# EAGLE design analogBuffer (EAGLE 5.09)
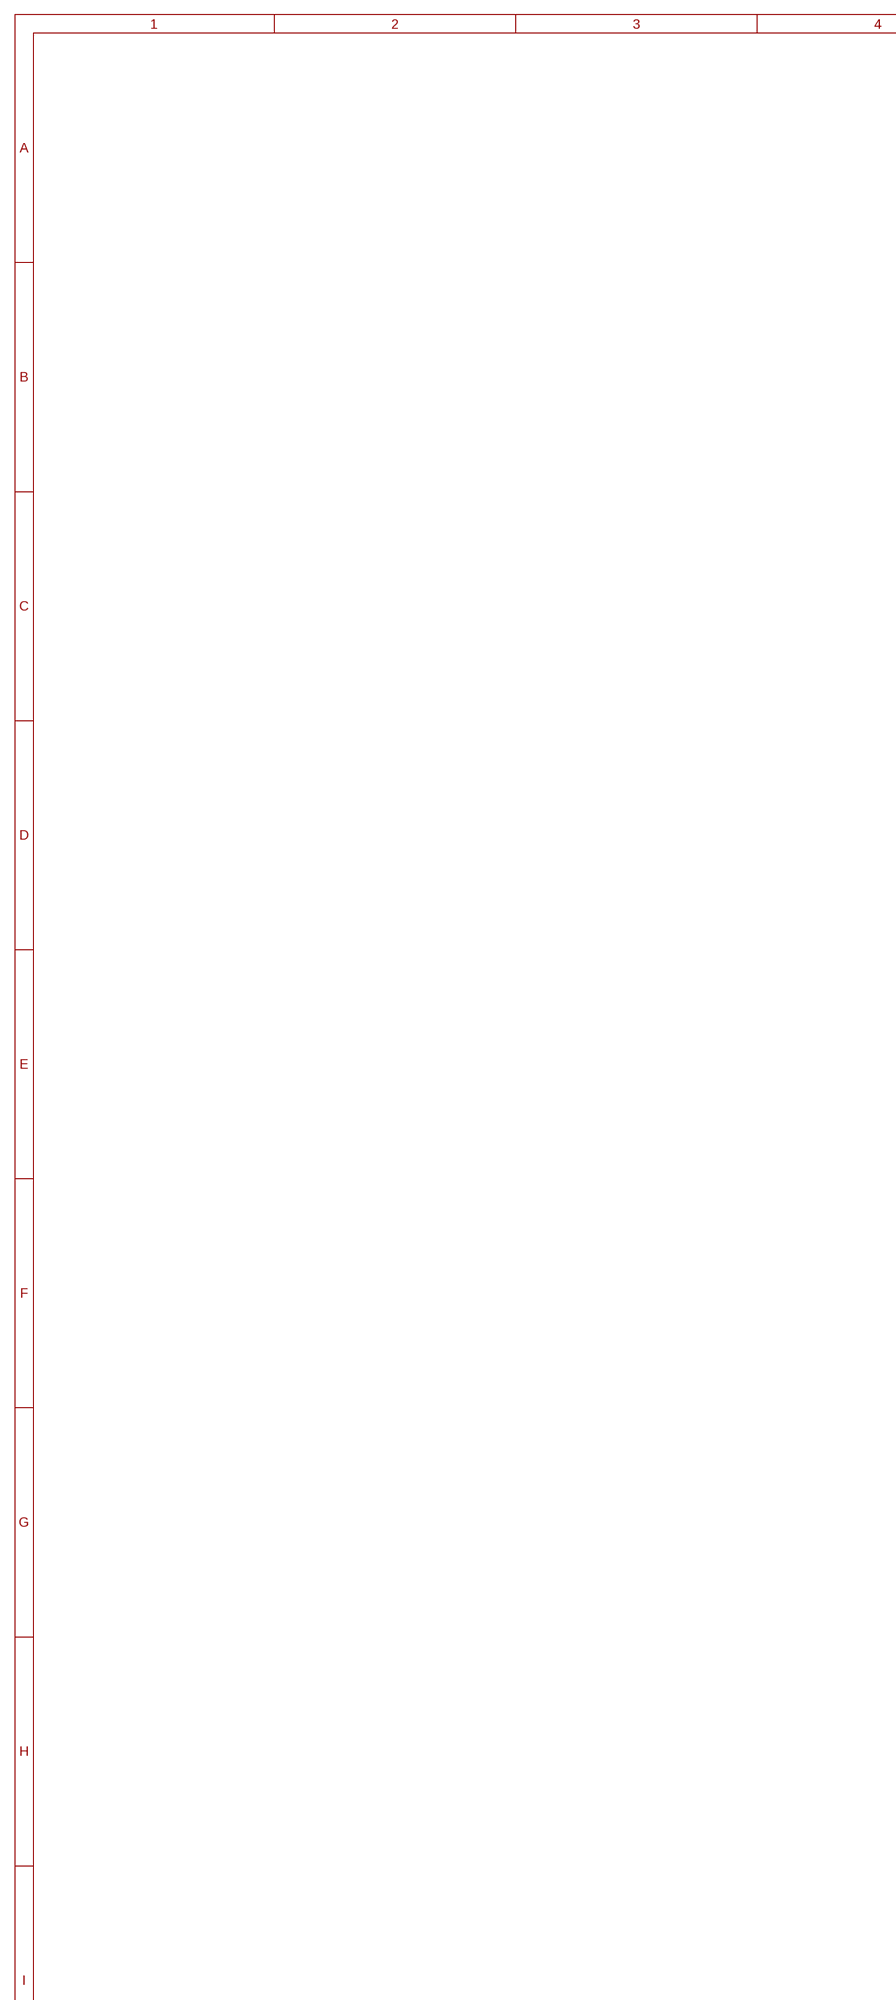
[diagram p0: schematic, sheet 1, part 1 of 2]
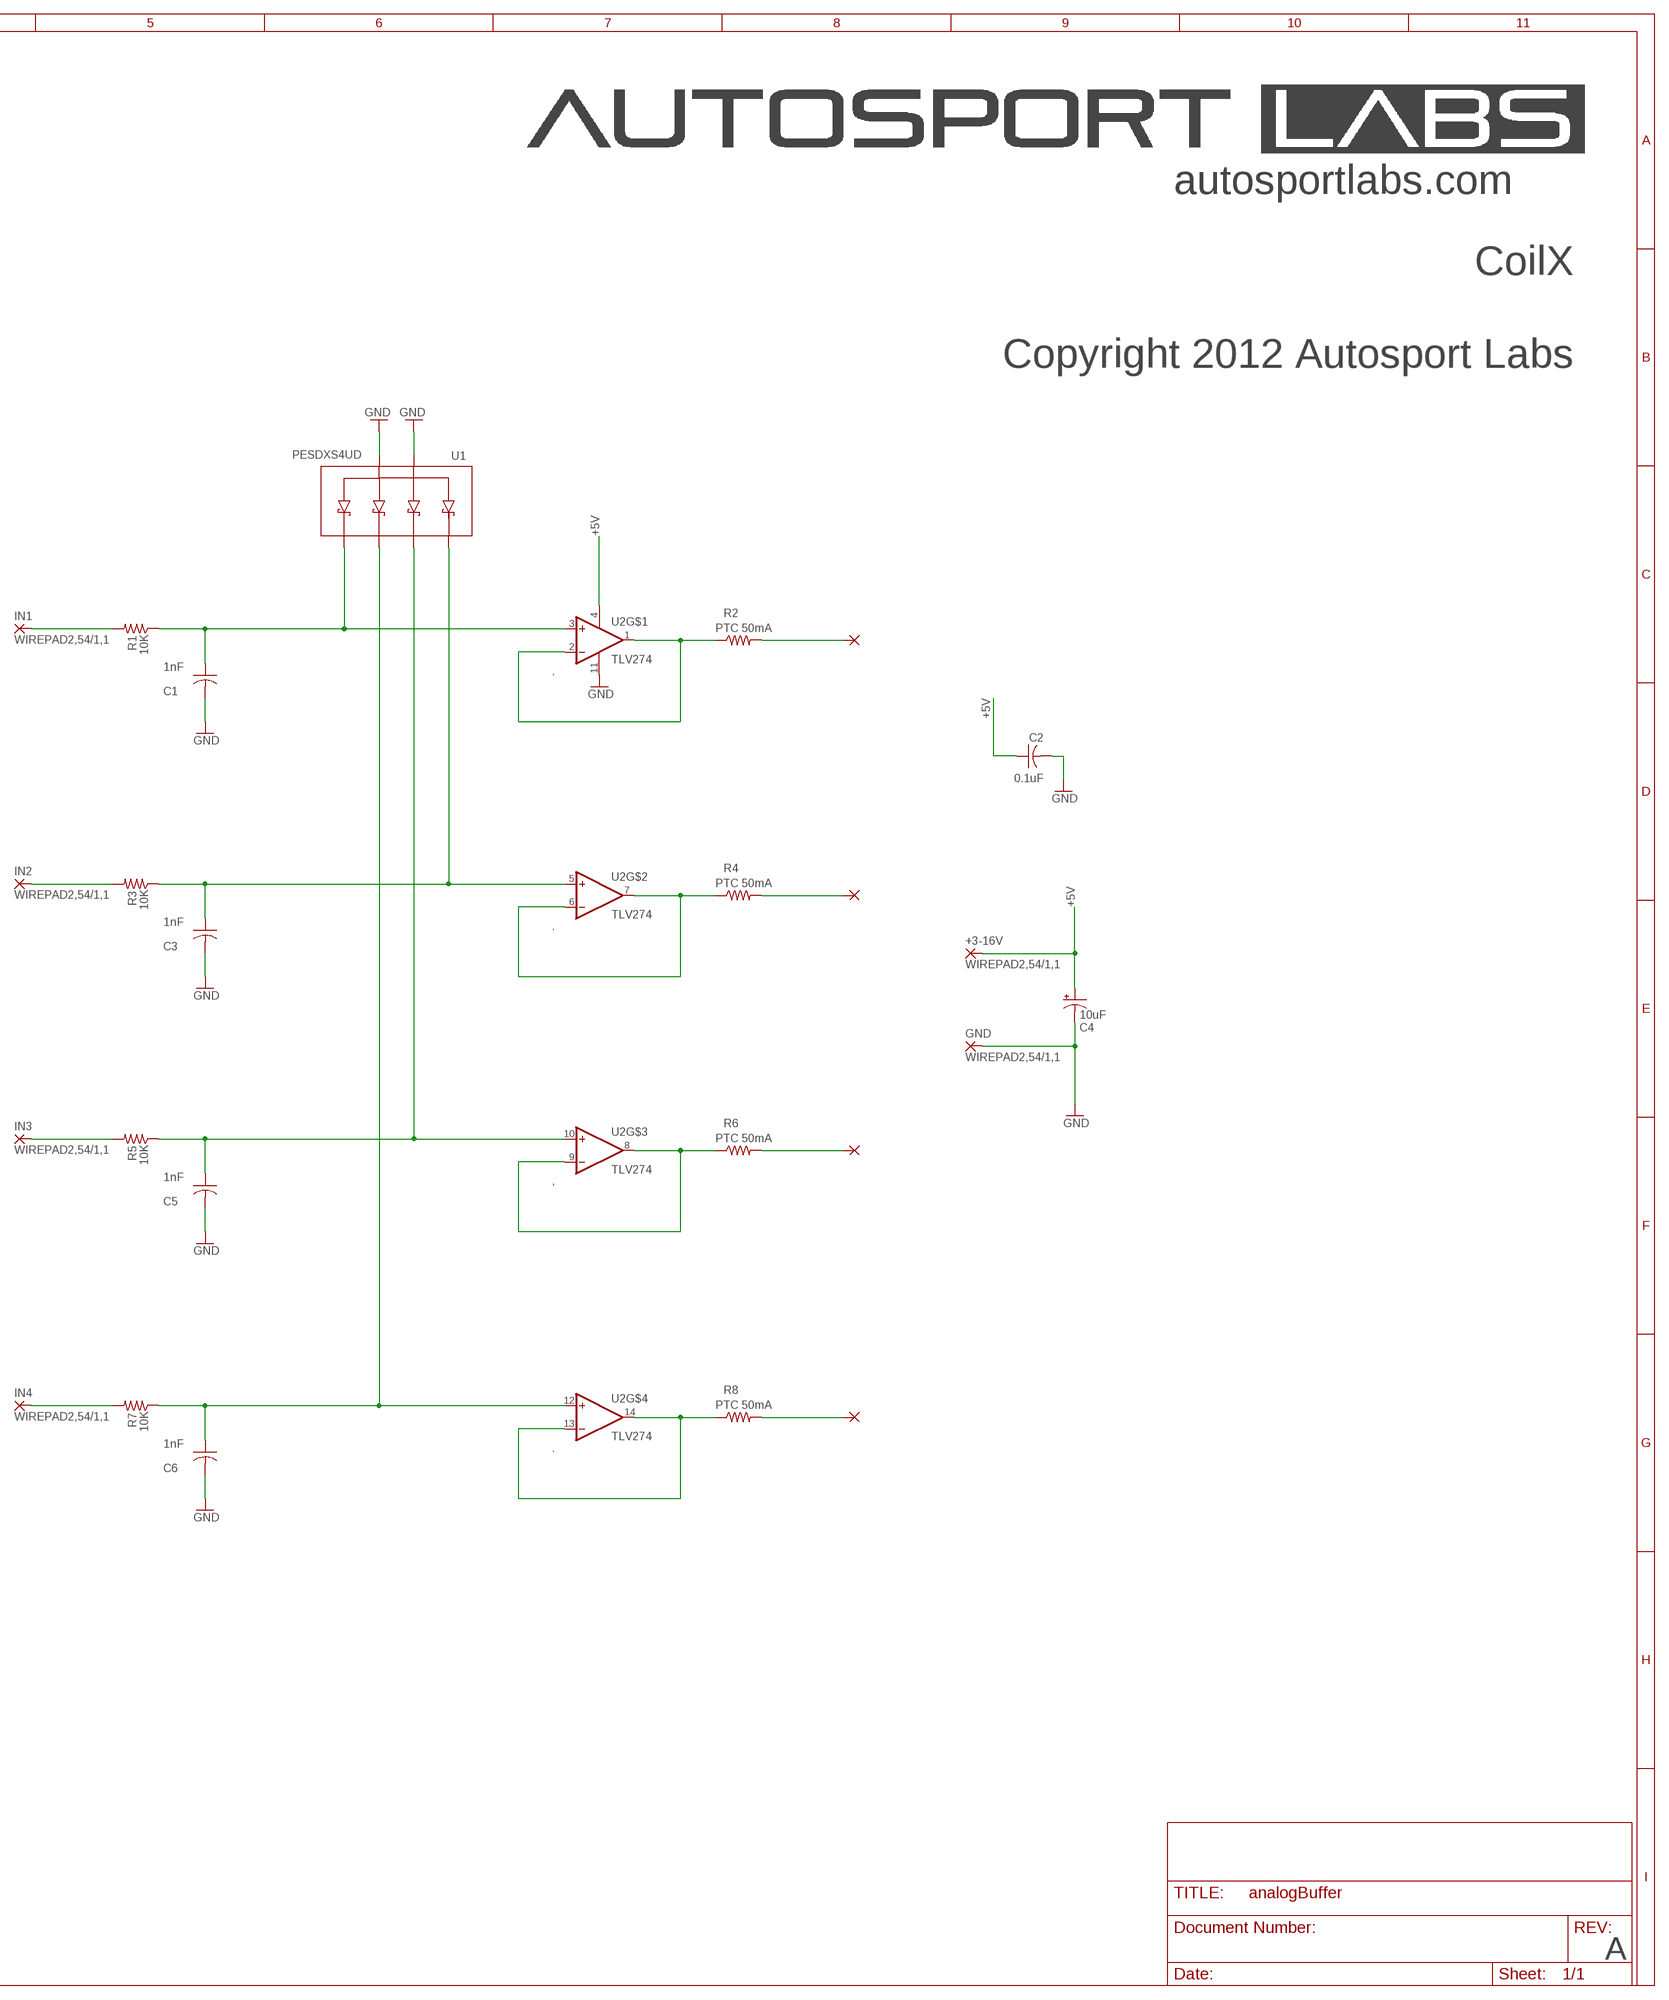
[diagram p1: schematic, sheet 1, part 2 of 2]

## Parts
+3-16V  WIREPAD2,54/1,1  [2,54/1,1]
C1  1nF  C-USC0603  [C0603]
C2  0.1uF  C-USC0603  [C0603]
C3  1nF  C-USC0603  [C0603]
C4  10uF  CPOL-USSMCA  [SMC_A]
C5  1nF  C-USC0603  [C0603]
C6  1nF  C-USC0603  [C0603]
GND  WIREPAD2,54/1,1  [2,54/1,1]
IN1  WIREPAD2,54/1,1  [2,54/1,1]
IN2  WIREPAD2,54/1,1  [2,54/1,1]
IN3  WIREPAD2,54/1,1  [2,54/1,1]
IN4  WIREPAD2,54/1,1  [2,54/1,1]
OUT1  WIREPAD2,54/1,1  [2,54/1,1]
OUT2  WIREPAD2,54/1,1  [2,54/1,1]
OUT3  WIREPAD2,54/1,1  [2,54/1,1]
OUT4  WIREPAD2,54/1,1  [2,54/1,1]
R1  10K  R-US_R1206  [R1206]
R2  PTC 50mA  R-US_R1206  [R1206]
R3  10K  R-US_R1206  [R1206]
R4  PTC 50mA  R-US_R1206  [R1206]
R5  10K  R-US_R1206  [R1206]
R6  PTC 50mA  R-US_R1206  [R1206]
R7  10K  R-US_R1206  [R1206]
R8  PTC 50mA  R-US_R1206  [R1206]
U1  PESDXS4UD  [SC-74]
U2  TLV274  TLV274SO14  [SO14]

## Nets
+5V: +3-16V.1(P) C2.1 C4.+ U2.4(V+)
ANALOG-FREQ_1_OPAMP_OUT: R2.1 U2.1(OUT) U2.2(-IN)
ANALOG-FREQ_1_OPAMP_OUT1: R4.1 U2.6(-IN) U2.7(OUT)
ANALOG-FREQ_1_OPAMP_OUT2: R6.1 U2.8(OUT) U2.9(-IN)
ANALOG-FREQ_1_OPAMP_OUT3: R8.1 U2.13(-IN) U2.14(OUT)
GND: C1.2 C2.2 C3.2 C4.- C5.2 C6.2 GND.1(P) U1.2 U1.5 U2.11(V-)
N$2: C1.1 R1.1 U1.6 U2.3(+IN)
N$3: IN1.1(P) R1.2
N$4: OUT1.1(P) R2.2
N$5: C3.1 R3.1 U1.1 U2.5(+IN)
N$6: IN2.1(P) R3.2
N$7: OUT2.1(P) R4.2
N$9: C5.1 R5.1 U1.3 U2.10(+IN)
N$11: IN3.1(P) R5.2
N$12: OUT3.1(P) R6.2
N$14: C6.1 R7.1 U1.4 U2.12(+IN)
N$15: IN4.1(P) R7.2
N$16: OUT4.1(P) R8.2

## Notes on the sheet
- autosportlabs.com
- CoilX
- Copyright 2012 Autosport Labs
- A

## Library data of the parts
+3-16V GND IN1-IN4 OUT1-OUT4 = wirepad:WIREPAD: Wire PAD connect wire on PCB
C1-C3 C5 C6 = rcl:C-US: CAPACITOR, American symbol
C4 = rcl:CPOL-US: POLARIZED CAPACITOR, American symbol
R1-R8 = rcl:R-US_: RESISTOR, American symbol
U1 = smt_diodes:PESDXS4UD
U2 = op_amps:TLV274

## Board
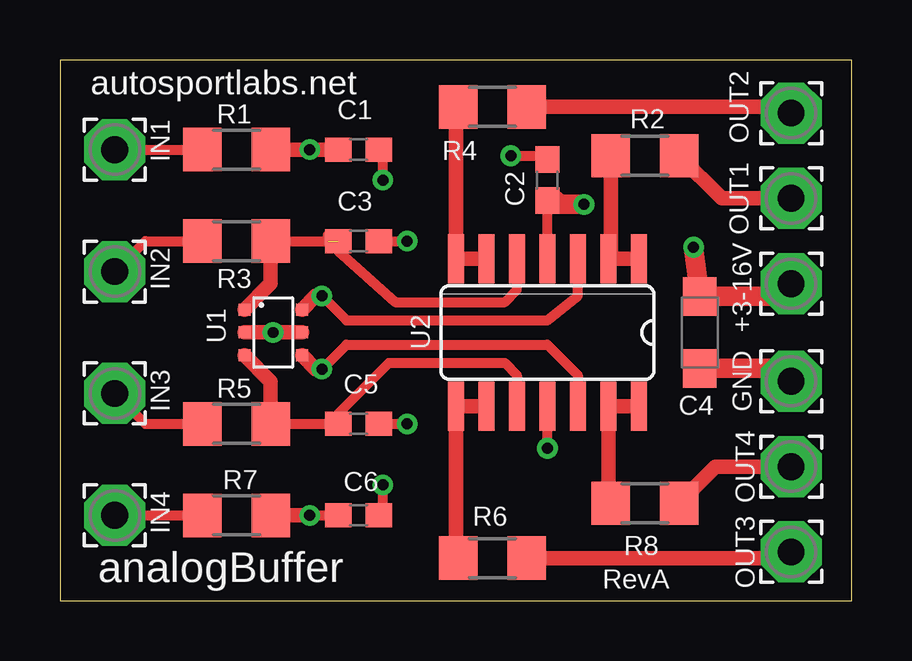
[diagram p2: board, top side]
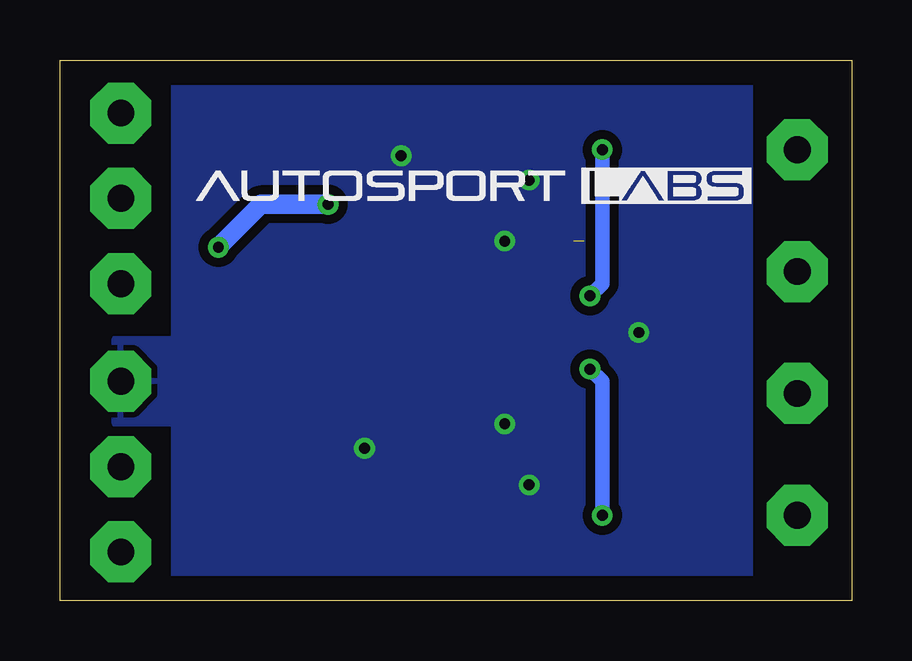
[diagram p3: board, bottom side, seen from below]

Size 33.02 x 22.53 mm. Coordinates in mm from the lower left corner, seen from the top.
Outline: 0,0 33.02,0 33.02,22.53 0,22.53 0,0
Copper layers (1*16): Top 0.035mm / dielectric 1.5mm / Bottom 0.035mm
Design rules "default *": minimum track width 10mil, minimum drill 24mil, track to track 15mil, track to pad 15mil, pad to pad 15mil, via to via 15mil, smd to smd 8mil, copper to edge 40mil, drill to drill 8mil, minimum pad ring 10mil, minimum via ring 8mil, stop-mask expansion 4mil, vias tented up to drill 20mil, thermal gap 10mil

### Footprints (pad centres in the part's own frame; a part is rotated, then mirrored left to right if it is on the bottom)
2,54/1,1 = drill 1.118 pad 2.54 octagon: 1 0,0
C0603 = smd 1.1 x 1: 1 -0.85,0; 2 0.85,0
SMC_A = smd 1.6 x 1.4: + -1.5,0; - 1.5,0
R1206 = smd 1.6 x 1.803: 1 -1.422,0; 2 1.422,0
SC-74 = smd 0.5 x 0.5: 1 -0.95,-1.2; 2 0,-1.2; 3 0.95,-1.2; 4 0.95,1.2; 5 0,1.2; 6 -0.95,1.2
SO14 = smd 0.66 x 2.032: 1 -3.81,-3.073; 2 -2.54,-3.073; 3 -1.27,-3.073; 4 0,-3.073; 5 1.27,-3.073; 6 2.54,-3.073; 7 3.81,-3.073; 8 3.81,3.073; 9 2.54,3.073; 10 1.27,3.073; 11 0,3.073; 12 -1.27,3.073; 13 -2.54,3.073; 14 -3.81,3.073

### Placement (x,y rotation side)
+3-16V  30.48,13.21 0 top
C1  12.45,18.8 0 top
C2  20.32,17.53 90 top
C3  12.45,14.99 0 top
C4  26.67,11.18 270 top
C5  12.45,7.37 0 top
C6  12.45,3.56 0 top
GND  30.48,9.14 0 top
IN1  2.29,18.8 90 top
IN2  2.29,13.72 90 top
IN3  2.29,8.64 90 top
IN4  2.29,3.56 90 top
OUT1  30.48,16.76 90 top
OUT2  30.48,20.32 90 top
OUT3  30.48,2.03 90 top
OUT4  30.48,5.59 90 top
R1  7.37,18.8 180 top
R2  24.38,18.54 0 top
R3  7.37,14.99 180 top
R4  18.03,20.57 0 top
R5  7.37,7.37 180 top
R6  18.03,1.78 0 top
R7  7.37,3.56 180 top
R8  24.38,4.06 0 top
U1  8.89,11.18 270 top
U2  20.32,11.18 180 top

### Tracks (layer width: path | path; a pad name or v marks a point on that pad's centre or on a via)
+5V  (via drill 0.46)
  Top 0.406: U2.4 C2.1
  Top 0.813: +3-16V.1 29.95,12.68 C4.+ v26.42,14.73 | v21.84,16.51 20.83,16.51 20.66,16.68 C2.1
  Bottom 0.813: v26.42,14.73 24.64,16.51 v21.84,16.51
ANALOG-FREQ_1_OPAMP_OUT
  Top 0.61: U2.1 U2.2 22.96,14.35 R2.1
ANALOG-FREQ_1_OPAMP_OUT1
  Top 0.61: R4.1 16.51,20.47 U2.7 U2.6
ANALOG-FREQ_1_OPAMP_OUT2
  Top 0.61: R6.1 16.51,1.88 U2.8 U2.9
ANALOG-FREQ_1_OPAMP_OUT3
  Top 0.61: R8.1 22.86,4.17 U2.13 U2.14
GND  (via drill 0.46)
  Top 0.406: C1.2 13.46,18.96 v13.46,17.53 | C3.2 v14.48,14.99 | C5.2 v14.48,7.37 | C6.2 13.46,3.72 v13.46,4.83 | v20.32,6.35 U2.11 | v18.8,18.54 20.49,18.54 C2.2
  Top 0.61: U1.2 v8.89,11.18 U1.5
  Top 0.813: GND.1 29.95,9.68 C4.-
  pour Bottom: 4.32,21.84 28.19,21.84 28.19,0.51 4.32,0.51
  pour Bottom: 27.69,7.37 30.73,7.37 30.73,10.92 27.69,10.92
N$2  (via drill 0.46)
  Top 0.406: v10.92,12.7 11.94,11.68 20.32,11.68 21.59,12.7 U2.3
  Top 0.61: R1.1 v10.41,18.8 C1.1 | v10.92,12.7 10.66,12.7 U1.6
  Bottom 0.61: v10.92,12.7 10.41,13.21 v10.41,18.8
N$3
  Top 0.406: IN1.1 R1.2
N$4
  Top 0.61: OUT1.1 27.58,16.76 R2.2
N$5  (1 unrouted)
  Top 0.406: 9.01,14.99 R3.1 11.18,14.99 11.18,15.24 | U2.5 19.05,12.95 18.54,12.45 13.97,12.45 11.6,14.57 C3.1
  Top 0.61: R3.1 8.79,13.22 U1.1
N$6
  Top 0.406: IN2.1 3.56,14.99 R3.2
N$7
  Top 0.61: R4.2 30.23,20.57 OUT2.1
N$9
  Top 0.406: R5.1 C5.1 11.6,7.79 13.72,9.91 18.54,9.91 19.05,9.4 U2.10
  Top 0.61: R5.1 8.79,9.13 U1.3
N$11
  Top 0.406: IN3.1 3.56,7.37 R5.2
N$12
  Top 0.61: R6.2 30.23,1.78 OUT3.1
N$14  (via drill 0.46)
  Top 0.406: v10.41,3.56 C6.1 | v10.92,9.65 11.94,10.67 20.32,10.67 21.59,9.4 U2.12
  Top 0.61: R7.1 v10.41,3.56 | v10.92,9.65 10.66,9.65 U1.4
  Bottom 0.61: v10.92,9.65 10.41,9.14 v10.41,3.56
N$15
  Top 0.406: IN4.1 R7.2
N$16
  Top 0.61: OUT4.1 27.33,5.59 R8.2

### Text on the board
tPlace: autosportlabs.net | analogBuffer | RevA